# EAGLE design pcbboard (EAGLE 9.6.2)
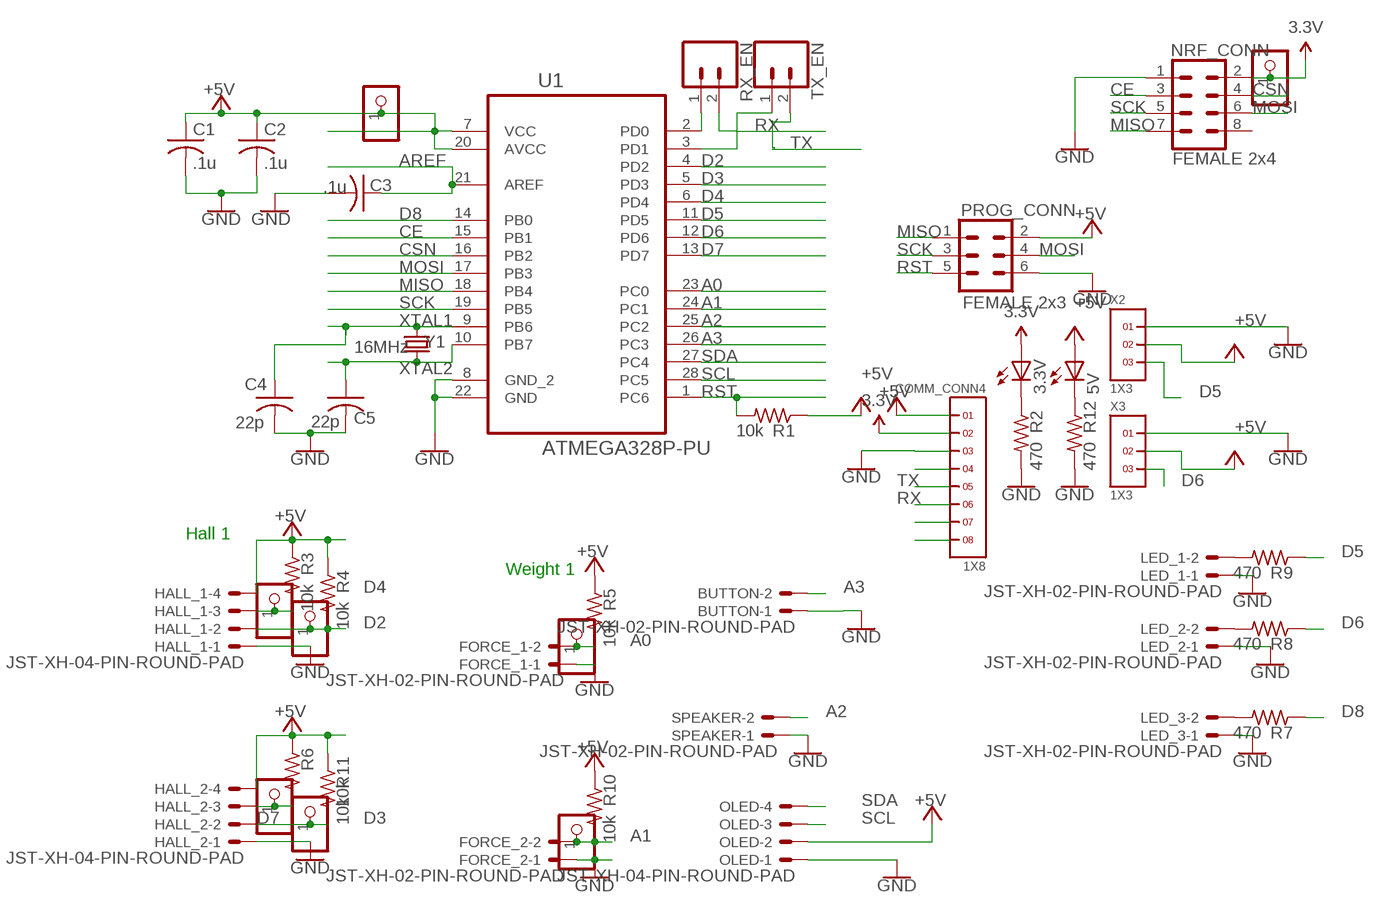
[diagram p0: schematic, sheet 1]

## Parts
3.3V  LED3MM  [LED3MM]
5V  LED3MM  [LED3MM]
BUTTON  JST-XH-02-PIN-ROUND-PAD  [JST-XH-02-PACKAGE-ROUND-PAD]
C1  .1u  C-USC0805  [C0805]
C2  .1u  C-USC0805  [C0805]
C3  .1u  C-USC0805  [C0805]
C4  22p  C-USC0805  [C0805]
C5  22p  C-USC0805  [C0805]
COMM_CONN4  1X8  [1X8]
FORCE_1  JST-XH-02-PIN-ROUND-PAD  [JST-XH-02-PACKAGE-ROUND-PAD]
FORCE_2  JST-XH-02-PIN-ROUND-PAD  [JST-XH-02-PACKAGE-ROUND-PAD]
HALL_1  JST-XH-04-PIN-ROUND-PAD  [JST-XH-04-PACKAGE-ROUND-PAD]
HALL_2  JST-XH-04-PIN-ROUND-PAD  [JST-XH-04-PACKAGE-ROUND-PAD]
LED_1  JST-XH-02-PIN-ROUND-PAD  [JST-XH-02-PACKAGE-ROUND-PAD]
LED_2  JST-XH-02-PIN-ROUND-PAD  [JST-XH-02-PACKAGE-ROUND-PAD]
LED_3  JST-XH-02-PIN-ROUND-PAD  [JST-XH-02-PACKAGE-ROUND-PAD]
NRF_CONN  FEMALE 2x4  CONN_04X2  [2X4]
OLED  JST-XH-04-PIN-ROUND-PAD  [JST-XH-04-PACKAGE-ROUND-PAD]
PROG_CONN  FEMALE 2x3  CONN_03X2FEMALE  [2X3]
R1  10k  R-US_R0805  [R0805]
R2  470  R-US_R0805  [R0805]
R3  10k  R-US_R0805  [R0805]
R4  10k  R-US_R0805  [R0805]
R5  10k  R-US_R0805  [R0805]
R6  10k  R-US_R0805  [R0805]
R7  470  R-US_R0805  [R0805]
R8  470  R-US_R0805  [R0805]
R9  470  R-US_R0805  [R0805]
R10  10k  R-US_R0805  [R0805]
R11  10k  R-US_R0805  [R0805]
R12  470  R-US_R0805  [R0805]
RX_EN  CONN_02  [1X02]
SPEAKER  JST-XH-02-PIN-ROUND-PAD  [JST-XH-02-PACKAGE-ROUND-PAD]
TP_3.3V  PINHD-1X1  [1X01]
TP_5V  PINHD-1X1  [1X01]
TP_F1  PINHD-1X1  [1X01]
TP_F2  PINHD-1X1  [1X01]
TP_H1-1  PINHD-1X1  [1X01]
TP_H1-2  PINHD-1X1  [1X01]
TP_H2-1  PINHD-1X1  [1X01]
TP_H2-2  PINHD-1X1  [1X01]
TX_EN  CONN_02  [1X02]
U1  ATMEGA328P-PU  [DIP254P762X457-28]
X2  1X3  [1X3]
X3  1X3  [1X3]
Y1  16MHz  CRYSTAL-8MHZSMD-5X3.2  [CRYSTAL-SMD-5X3.2-4PAD]

## Nets
3.3V: 3.3V.A COMM_CONN4.2 NRF_CONN.2 TP_3.3V.1
+5V: 5V.A C1.1 C2.1 COMM_CONN4.1 HALL_1.4 HALL_2.4 OLED.2 PROG_CONN.2 R1.1 R3.1 R4.1 R5.1 R6.1 R10.1 R11.1 TP_5V.1 U1.7(VCC) U1.20(AVCC) X2.2 X3.2
A0: FORCE_1.2 R5.2 TP_F1.1 U1.23(PC0)
A1: FORCE_2.2 R10.2 TP_F2.1 U1.24(PC1)
A2: SPEAKER.2 U1.25(PC2)
A3: BUTTON.2 U1.26(PC3)
AREF: C3.1 U1.21(AREF)
CE: NRF_CONN.3 U1.15(PB1)
CSN: NRF_CONN.4 U1.16(PB2)
D2: HALL_1.2 R4.2 TP_H1-2.1 U1.4(PD2)
D3: HALL_2.2 R11.2 TP_H2-2.1 U1.5(PD3)
D4: HALL_1.3 R3.2 TP_H1-1.1 U1.6(PD4)
D5: R9.1 U1.11(PD5) X2.3
D6: R8.1 U1.12(PD6) X3.3
D7: HALL_2.3 R6.2 TP_H2-1.1 U1.13(PD7)
D8: R7.1 U1.14(PB0)
GND: BUTTON.1 C1.2 C2.2 C3.2 C4.2 C5.2 COMM_CONN4.3 FORCE_1.1 FORCE_2.1 HALL_1.1 HALL_2.1 LED_1.1 LED_2.1 LED_3.1 NRF_CONN.1 OLED.1 PROG_CONN.6 R2.2 R12.2 SPEAKER.1 U1.8(GND_2) U1.22(GND) X2.1 X3.1
MISO: NRF_CONN.7 PROG_CONN.1 U1.18(PB4)
MOSI: NRF_CONN.6 PROG_CONN.4 U1.17(PB3)
N$2: LED_3.2 R7.2
N$3: LED_2.2 R8.2
N$4: LED_1.2 R9.2
N$5: COMM_CONN4.4
N$6: 3.3V.K(C) R2.1
N$7: 5V.K(C) R12.1
N$8: COMM_CONN4.7
N$9: COMM_CONN4.8
N$10: RX_EN.1 U1.2(PD0)
N$11: TX_EN.1 U1.3(PD1)
RST: PROG_CONN.5 R1.2 U1.1(PC6)
RX: COMM_CONN4.6 RX_EN.2
SCK: NRF_CONN.5 PROG_CONN.3 U1.19(PB5)
SCL: OLED.3 U1.28(PC5)
SDA: OLED.4 U1.27(PC4)
TX: COMM_CONN4.5 TX_EN.2
XTAL1: C4.1 U1.9(PB6) Y1.1
XTAL2: C5.1 U1.10(PB7) Y1.3
Unconnected: NRF_CONN.8

## Notes on the sheet
- Hall 1
- Weight 1

## Library data of the parts
3.3V 5V = adafruit:LED: LED OSRAM: - CHIPLED LG R971, LG N971, LY N971, LG Q971, LY Q971, LO R971, LY R971 LH N974, LH R974 LS Q976, LO Q976, LY Q976 LO Q996 - Hyper CHIPLED LW Q18S LB Q993, LB Q99A, LB R99A - SideLED LS A670, LO A670, LY A670, LG A670, LP A670 LB A673, LV A673, LT A673, LW A673 LH A674 LY A675 LS A676, LA A676, LO A676, LY A676, LW A676 LS A679, LY A679, LG A679 - Hyper Micro SIDELED® LS Y876, LA Y876, LO Y876, LY Y876 LT Y87S - SmartLED LW L88C, LW L88S LB L89C, LB L89S, LG L890 LS L89K, LO L89K, LY L89K LS L896, LA L896, LO L896, LY L896 - TOPLED LS T670, LO T670, LY T670, LG T670, LP T670 LSG T670, LSP T670, LSY T670, LOP T670, LYG T670 LG T671, LOG T671, LSG T671 LB T673, LV T673, LT T673, LW T673 LH T674 LS T676, LA T676, LO T676, LY T676, LB T676, LH T676, LSB T676, LW T676 LB T67C, LV T67C, LT T67C, LS T67K, LO T67K, LY T67K, LW E67C LS E67B, LA E67B, LO E67B, LY E67B, LB E67C, LV E67C, LT E67C LW T67C LS T679, LY T679, LG T679 LS T770, LO T770, LY T770, LG T770, LP T770 LB T773, LV T773, LT T773, LW T773 LH T774 LS E675, LA E675, LY E675, LS T675 LS T776, LA T776, LO T776, LY T776, LB T776 LHGB T686 LT T68C, LB T68C - Hyper Mini TOPLED® LB M676 - Mini TOPLED Santana® LG M470 LS M47K, LO M47K, LY M47K Source: http://www.osram.convergy.de/
BUTTON FORCE_1 FORCE_2 LED_1-LED_3 SPEAKER = Rembrandt Electronics - JST XH Connectors v1-0:JST-XH-02-PIN: JST XH Connector 2 Pin Wire to board connector. Pitch: 2,54 mm, (0.100") Number of pins: 2 Created by Rembrandt Electronics www.rembrandtelectronics.com
C1-C5 = rcl:C-US: CAPACITOR, American symbol; SPICEPREFIX: C
COMM_CONN4 = headers(2mm):1X8
HALL_1 HALL_2 OLED = Rembrandt Electronics - JST XH Connectors v1-0:JST-XH-04-PIN: JST XH Connector 2 Pin Wire to board connector. Pitch: 2,54 mm, (0.100") Number of pins: 4 Created by Rembrandt Electronics www.rembrandtelectronics.com
NRF_CONN = SparkFun-Connectors:CONN_04X2: Multi connection point. Often used as Generic Header-pin footprint for 0.1 inch spaced/style header connections On any of the 0.1 inch spaced packages, you can populate with these: Break Away Headers - Straight <https://www.sparkfun.com/products/116> (PRT-00116) Break Away Male Headers - Right Angle <https://www.sparkfun.com/products/553> (PRT-00553) Female Headers <https://www.sparkfun.com/products/115> (PRT-00115) Break Away Headers - Machine Pin <https://www.sparkfun.com/products/117> (PRT-00117) Break Away Female Headers - Swiss Machine Pin <https://www.sparkfun.com/products/743> (PRT-00743)
PROG_CONN = SparkFun-Connectors:CONN_03X2: Multi connection point. Often used as Generic Header-pin footprint for 0.1 inch spaced/style header connections You can populate with any combo of single row headers, but if you'd like an exact match, check these: Header - 2x3 (Male, 0.1") <https://www.sparkfun.com/products/12807> (PRT-12807) Header - 2x3 (Female, 0.1") <https://www.sparkfun.com/products/13010> (PRT-13010) 2x3 Pin Shrouded Header <https://www.sparkfun.com/products/10877> (PRT-10877) On any of the 0.1 inch spaced packages, you can populate with these: Break Away Headers - Straight <https://www.sparkfun.com/products/116> (PRT-00116) Break Away Male Headers - Right Angle <https://www.sparkfun.com/products/553> (PRT-00553) Female Headers <https://www.sparkfun.com/products/115> (PRT-00115) Break Away Headers - Machine Pin <https://www.sparkfun.com/products/117> (PRT-00117) Break Away Female Headers - Swiss Machine Pin <https://www.sparkfun.com/products/743> (PRT-00743) Special note: the shrouded connector mates well with our 3x2 ribbon cables: Ribbon Crimp Connector - 6-pin (2x3, Female) <https://www.sparkfun.com/products/10651> (PRT-10651) Ribbon Cable - 6 wire (15ft) <https://www.sparkfun.com/products/10646> (PRT-10646); PROD_ID: CONN-11566
R1-R12 = rcl:R-US_: RESISTOR, American symbol; SPICEPREFIX: R
RX_EN TX_EN = SparkFun-Connectors:CONN_02: Multi connection point. Often used as Generic Header-pin footprint for 0.1 inch spaced/style header connections On any of the 0.1 inch spaced packages, you can populate with these: Break Away Headers - Straight <https://www.sparkfun.com/products/116> (PRT-00116) Break Away Male Headers - Right Angle <https://www.sparkfun.com/products/553> (PRT-00553) Female Headers <https://www.sparkfun.com/products/115> (PRT-00115) Break Away Headers - Machine Pin <https://www.sparkfun.com/products/117> (PRT-00117) Break Away Female Headers - Swiss Machine Pin <https://www.sparkfun.com/products/743> (PRT-00743) For SCREWTERMINALS and SPRING TERMINALS visit here: Screw Terimnals on SparkFun.com <https://www.sparkfun.com/search/results?term=Screw+Terminals> (5mm/3.5mm/2.54mm spacing) This device is also useful as a general connection point to wire up your design to another part of your project. Our various solder wires solder well into these plated through hole pads. Hook-Up Wire - Assortment (Stranded, 22 AWG) <https://www.sparkfun.com/products/11375> (PRT-11375) Hook-Up Wire - Assortment (Solid Core, 22 AWG) <https://www.sparkfun.com/products/11367> (PRT-11367) View the entire wire category on our website here <https://www.sparkfun.com/categories/141> Special notes: Molex polarized connector foot print use with: PRT-08233 with associated crimp pins and housings. 2.54_SCREWTERM for use with PRT-10571. 3.5mm Screw Terminal footprints for PRT-08084 5mm Screw Terminal footprints for use with PRT-08432
TP_3.3V TP_5V TP_F1 TP_F2 TP_H1-1 TP_H1-2 TP_H2-1 TP_H2-2 = pinhead:PINHD-1X1: PIN HEADER
U1 = Atmel_By_element14_Batch_1-00:ATMEGA328P-PU: 8-bit Microcontroller with In-System Programmable Flash; MPN: ATMEGA328P-PU; OC_FARNELL: 1715487; OC_NEWARK: 15R0268; PACKAGE: PDIP-28; SUPPLIER: Atmel
X2 X3 = headers(2mm):1X3
Y1 = SparkFun-Clocks:CRYSTAL-8MHZ: 8MHz Crystal Datasheet Example <http://www.futureelectronics.com/en/technologies/electromechanical/timing-devices/crystals/Pages/6008189-ABM3B-8.000MHZ-B2-T.aspx?IM=0> Frequency: 8MHz Frequency Tolerance: ±20ppm Load Capacitance: 18pF SparkFun Products: Pro Micro -3.3V/8MHz <https://www.sparkfun.com/products/12587> WAV Trigger <https://www.sparkfun.com/products/13660>; PROD_ID: XTAL-09431; VALUE: 8MHz

## Board
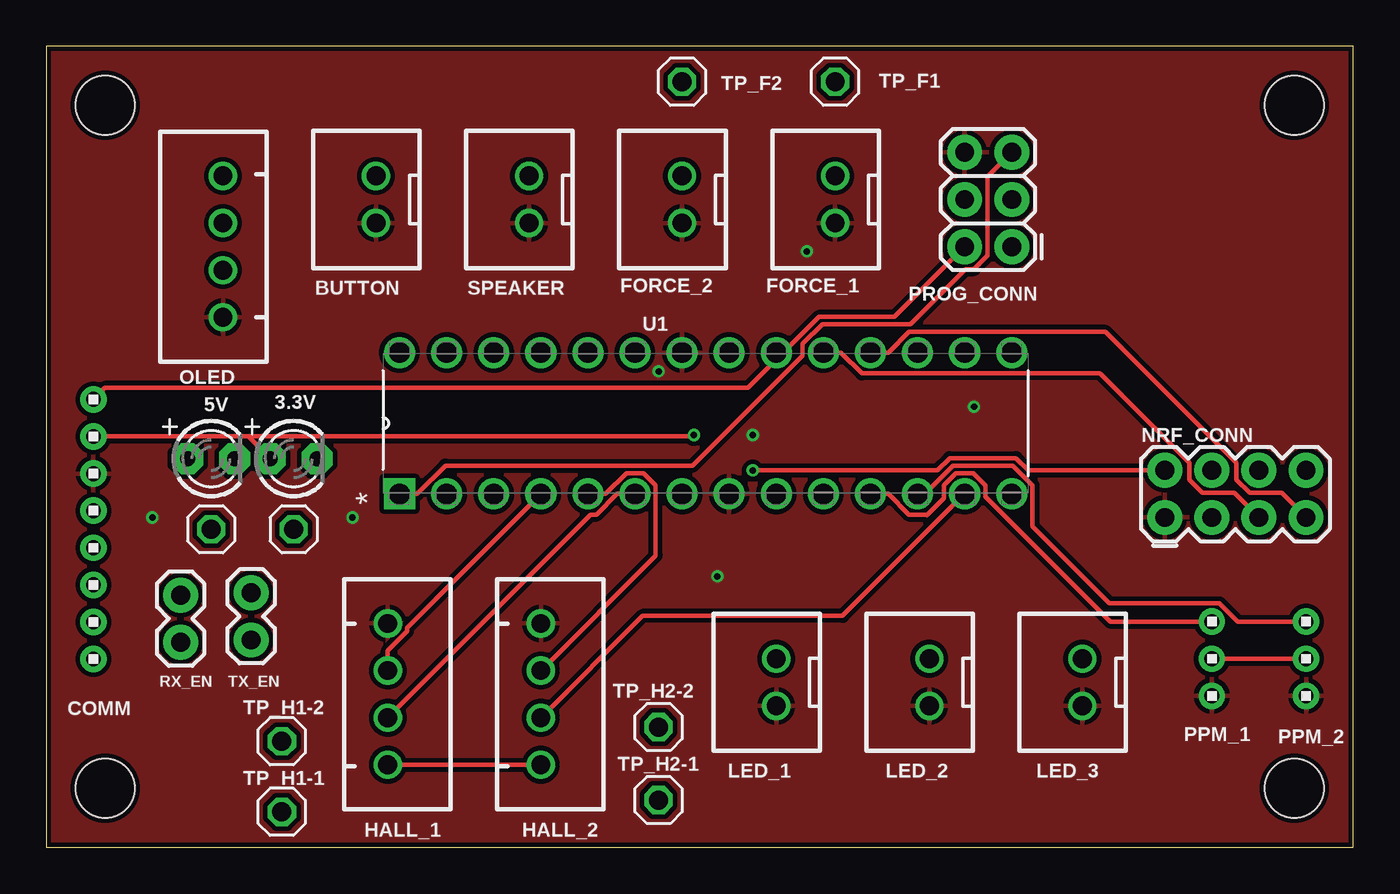
[diagram p1: board, top side]
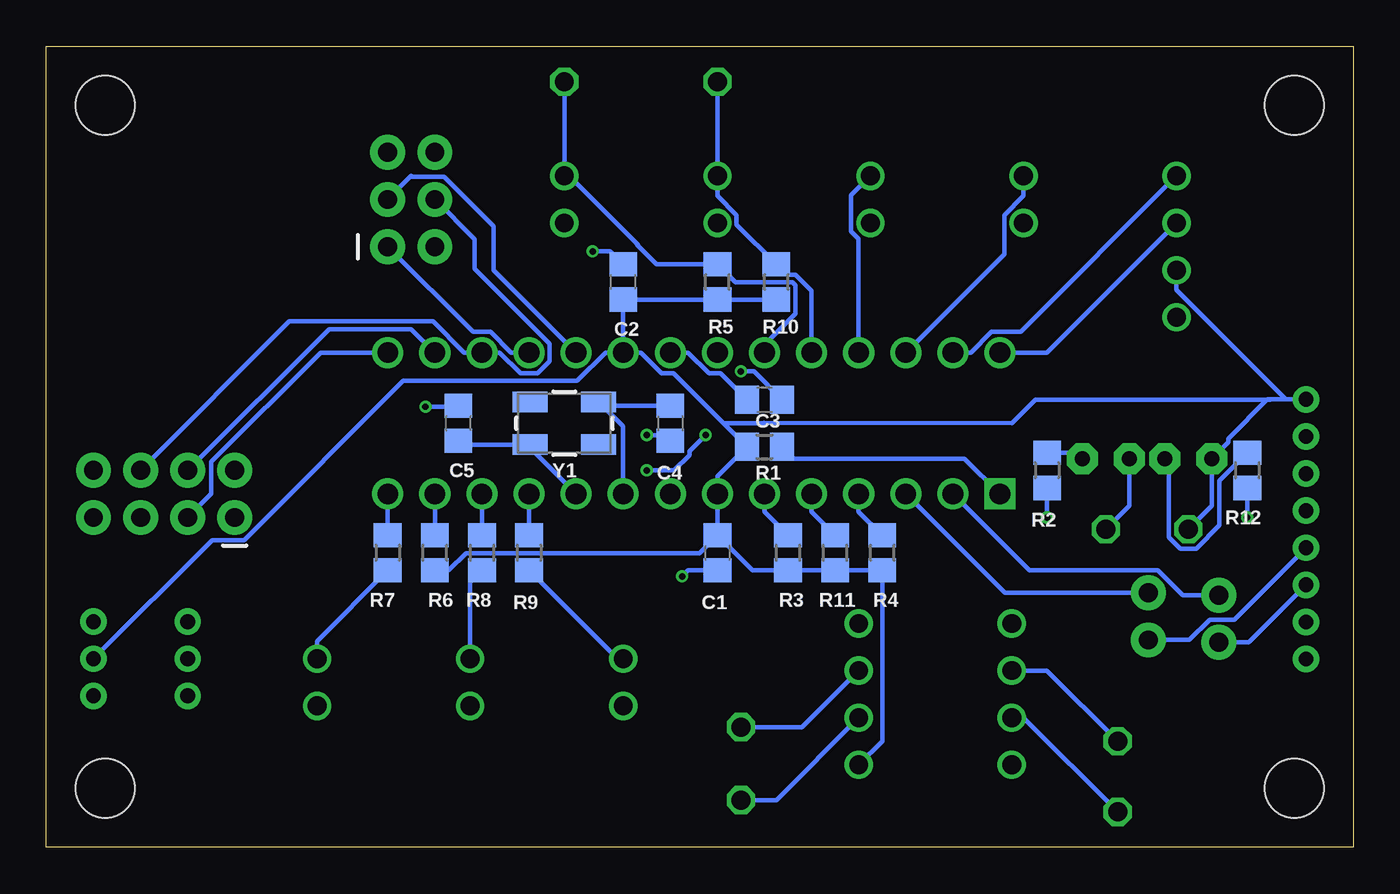
[diagram p2: board, bottom side, seen from below]

Size 70.48 x 43.18 mm. Coordinates in mm from the lower left corner, seen from the top.
Outline: 0,0 70.48,0 70.48,43.18 0,43.18 0,0
Copper layers (1*16): Top 0.035mm / dielectric 1.5mm / Bottom 0.035mm
Design rules "PCBWay_2layer": minimum track width 6mil, minimum drill 0.3mm, track to track 6mil, track to pad 6mil, pad to pad 6mil, via to via 6mil, smd to smd 4mil, copper to edge 10mil, drill to drill 6mil, minimum pad ring 6mil, minimum via ring 6mil, stop-mask expansion 4mil, vias tented up to drill 0.8mm, thermal gap 10mil
Holes 3.2 mm at 3.18,40.01 3.18,3.17 67.31,3.17 67.31,40.01

### Footprints (pad centres in the part's own frame; a part is rotated, then mirrored left to right if it is on the bottom)
LED3MM = drill 0.813 pad 1.676 octagon: A -1.27,0; K 1.27,0
JST-XH-02-PACKAGE-ROUND-PAD = drill 1.016: 1 -1.27,0; 2 1.27,0
C0805 = smd 1.3 x 1.5: 1 -0.95,0; 2 0.95,0
1X8 = drill 0.8 pad 1.422: 1 -7,0; 2 -5,0; 3 -3,0; 4 -1,0; 5 1,0; 6 3,0; 7 5,0; 8 7,0
JST-XH-04-PACKAGE-ROUND-PAD = drill 1.016: 1 -3.81,0; 2 -1.27,0; 3 1.27,0; 4 3.81,0
2X4 = drill 1.016 pad 1.88: 1 -3.81,-1.27; 2 -3.81,1.27; 3 -1.27,-1.27; 4 -1.27,1.27; 5 1.27,-1.27; 6 1.27,1.27; 7 3.81,-1.27; 8 3.81,1.27
2X3 = drill 1.016 pad 1.88: 1 0,0; 2 0,2.54; 3 2.54,0; 4 2.54,2.54; 5 5.08,0; 6 5.08,2.54
R0805 = smd 1.3 x 1.5: 1 -0.95,0; 2 0.95,0
1X02 = drill 1.016 pad 1.88: 1 0,0; 2 2.54,0
1X01 = drill 1.016 octagon: 1 0,0
DIP254P762X457-28 = drill 1.118 square: 1 -7.62,33.02 | drill 1.118: 2 -7.62,30.48; 3 -7.62,27.94; 4 -7.62,25.4; 5 -7.62,22.86; 6 -7.62,20.32; 7 -7.62,17.78; 8 -7.62,15.24; 9 -7.62,12.7; 10 -7.62,10.16; 11 -7.62,7.62; 12 -7.62,5.08; 13 -7.62,2.54; 14 -7.62,0; 15 0,0; 16 0,2.54; 17 0,5.08; 18 0,7.62; 19 0,10.16; 20 0,12.7; 21 0,15.24; 22 0,17.78; 23 0,20.32; 24 0,22.86; 25 0,25.4; 26 0,27.94; 27 0,30.48; 28 0,33.02
1X3 = drill 0.8 pad 1.422: 1 -2,0; 2 0,0; 3 2,0
CRYSTAL-SMD-5X3.2-4PAD = smd 1.9 x 1.1: 1 -1.85,-1.15; 2 1.85,-1.15; 3 1.85,1.15; 4 -1.85,1.15

### Placement (x,y rotation side)
3.3V  13.34,20.95 0 top
5V  8.89,20.95 0 top
BUTTON  17.78,34.92 90 top
C1  34.29,15.88 270 bottom
C2  39.37,30.48 90 bottom
C3  31.75,24.13 0 bottom
C4  36.83,22.86 270 bottom
C5  48.26,22.86 90 bottom
COMM_CONN4  2.54,17.14 270 top
FORCE_1  42.55,34.92 90 top
FORCE_2  34.29,34.92 90 top
HALL_1  18.41,8.25 270 top
HALL_2  26.67,8.25 270 top
LED_1  39.37,8.89 90 top
LED_2  47.62,8.89 90 top
LED_3  55.88,8.89 90 top
NRF_CONN  64.13,19.05 0 top
OLED  9.53,32.38 90 top
PROG_CONN  52.07,32.38 90 top
R1  31.75,21.59 0 bottom
R2  16.51,20.32 270 bottom
R3  30.48,15.88 90 bottom
R4  25.4,15.88 90 bottom
R5  34.29,30.48 90 bottom
R6  49.53,15.88 90 bottom
R7  52.07,15.88 270 bottom
R8  46.99,15.88 270 bottom
R9  44.45,15.88 270 bottom
R10  31.12,30.48 90 bottom
R11  27.94,15.88 90 bottom
R12  5.71,20.32 270 bottom
RX_EN  7.24,13.59 270 top
SPEAKER  26.04,34.92 90 top
TP_3.3V  13.34,17.14 0 top
TP_5V  8.89,17.14 0 top
TP_F1  42.55,41.27 270 top
TP_F2  34.29,41.27 270 top
TP_H1-1  12.7,1.91 270 top
TP_H1-2  12.7,5.71 270 top
TP_H2-1  33.02,2.54 270 top
TP_H2-2  33.02,6.48 270 top
TX_EN  11.05,13.72 270 top
U1  52.07,26.67 90 top
X2  62.87,10.16 90 top
X3  67.94,10.16 90 top
Y1  42.55,22.86 180 bottom

### Tracks (layer width: path | path; a pad name or v marks a point on that pad's centre or on a via)
3.3V  (via drill 0.35)
  Top 0.254: 3.3V.A 10.88,22.14 COMM_CONN4.2 34.84,22.14 v34.92,22.22 | v38.1,20.32 48.07,20.32 48.73,20.98 52.3,20.98 52.95,20.32 NRF_CONN.2
  Bottom 0.254: TP_3.3V.1 12.06,18.41 3.3V.A | v34.92,22.22 35.8,21.35 35.8,21.14 36.62,20.32 v38.1,20.32
+5V
  Top 0.254: HALL_1.4 HALL_2.4 | PROG_CONN.2 45.75,28.6 41.69,28.6 37.85,24.77 3.16,24.77 COMM_CONN4.1 | X2.2 X3.2
  Bottom 0.254: 33.96,22.85 R1.1 34.29,20 U1.7 C1.1 | U1.20 38.41,26.67 37.29,25.55 36.66,25.55 33.96,22.85 | U1.20 C2.1 34.92,29.53 | 34.92,29.53 R5.1 | R10.1 34.92,29.53 | TP_5V.1 7.62,18.41 5V.A 6.74,21.83 6.74,22.04 4.63,24.14 COMM_CONN4.1 | COMM_CONN4.1 4.45,24.14 4.46,24.13 17.14,24.13 18.41,22.86 31.77,22.88 31.77,22.85 33.96,22.85 | COMM_CONN4.1 3.62,24.14 9.53,30.05 OLED.2 | C1.1 32.39,14.93 R3.1 R11.1 R4.1 25.4,5.71 HALL_2.4 | R6.1 48.78,14.93 47.86,15.85 35.26,15.85 C1.1 | X3.2 61.54,16.56 59.82,16.56 51.23,25.15 41.85,25.15 40.33,26.67 U1.20
A0
  Bottom 0.254: U1.23 31.75,27.1 30.09,28.76 30.09,30.3 30.25,30.46 33.32,30.46 R5.2 37.58,31.43 38.63,32.49 38.58,32.49 42.29,36.2 FORCE_1.2 TP_F1.1
A1
  Bottom 0.254: U1.24 29.21,29.99 30.08,30.87 30.55,30.87 R10.2 33.25,33.56 33.25,34.09 34.29,35.13 FORCE_2.2 TP_F2.1
A2
  Bottom 0.254: U1.25 26.67,32.82 27.08,33.22 27.08,35.15 SPEAKER.2
A3
  Bottom 0.254: U1.26 18.82,31.98 18.82,34.09 17.78,35.13 BUTTON.2
AREF
  Bottom 0.254: C3.1 34.12,25.55 34.75,25.55 35.87,26.67 U1.21
CE
  Bottom 0.254: NRF_CONN.3 61.59,19.05 61.59,20.77 55.7,26.67 U1.15
CSN
  Bottom 0.254: U1.16 50.8,27.94 55.24,27.94 NRF_CONN.4
D2
  Top 0.254: U1.4 19.46,11.84 19.46,11.63 18.41,10.59 HALL_1.2
  Bottom 0.254: 24.84,16.26 R4.2 26.67,18.09 U1.4 | TP_H1-2.1 16.51,9.53 HALL_1.2
D3
  Top 0.254: U1.5 30.17,19.05 31.29,20.17 32.21,20.17 32.87,19.51 32.87,15.72 HALL_2.2
  Bottom 0.254: U1.5 29.21,18.09 R11.2 | TP_H2-2.1 29.72,6.48 HALL_2.2
D4
  Top 0.254: HALL_1.3 29.36,17.93 29.67,17.93 30.79,19.05 U1.6
  Bottom 0.254: U1.6 31.75,18.09 R3.2 | TP_H1-1.1 17.78,6.99 HALL_1.3
D5
  Top 0.254: U1.11 45.41,19.05 46.53,17.93 47.47,17.93 47.5,17.91 48.41,18.82 48.41,19.51 49.07,20.17 49.99,20.17 50.65,19.51 50.65,18.89 57.38,12.16 X2.3
  Bottom 0.254: U1.11 R9.1
D6
  Top 0.254: U1.12 47.38,19.05 48.9,20.57 52.13,20.57 53.19,19.51 53.19,17.3 57.33,13.15 63.27,13.15 64.27,12.16 X3.3
  Bottom 0.254: U1.12 R8.1
D7
  Top 0.254: U1.13 42.95,12.47 32.16,12.47 HALL_2.3
  Bottom 0.254: U1.13 R6.2 | TP_H2-1.1 31.12,2.54 HALL_2.3
D8
  Bottom 0.254: U1.14 R7.1
GND  (via drill 0.35)
  Bottom 0.254: C4.2 37.14,22.22 v38.1,22.22 | v16.51,17.78 R2.2 | C1.2 35.88,14.93 v36.2,14.61 | C2.2 40.07,32.13 v41.02,32.13 | R12.2 v5.71,17.78 | v50.04,23.75 48.32,23.75 C5.2 | C3.2 32.32,25.65 v33.02,25.65
  pour Top (isolate 0.254): -0.63,43.81 71.12,43.81 71.12,-1.27 -0.63,-1.27 -1.27,-0.63 -1.27,43.18
MISO
  Top 0.254: NRF_CONN.7 66.62,19.1 64.9,19.1 64.19,19.81 64.19,20.72 57.12,27.79 46.53,27.79 45.41,26.67 U1.18
  Bottom 0.254: PROG_CONN.1 47.47,27.79 46.53,27.79 45.41,26.67 U1.18
MOSI
  Bottom 0.254: PROG_CONN.4 47.4,32.79 47.4,31.2 43.33,27.13 43.33,26.21 43.99,25.55 44.91,25.55 46.03,26.67 U1.17 47.95,26.67 49.63,28.35 57.38,28.35 NRF_CONN.6
N$2
  Bottom 0.254: R7.2 55.88,11.11 LED_3.2
N$3
  Bottom 0.254: R8.2 47.62,14.29 LED_2.2
N$4
  Bottom 0.254: R9.2 39.69,10.16 LED_1.2
N$6
  Bottom 0.254: R2.1 14.92,21.27 3.3V.K
N$7
  Bottom 0.254: R12.1 7.21,19.77 7.21,17.35 8.46,16.1 9.32,16.1 9.93,16.71 9.93,20.73 5V.K
N$10
  Bottom 0.254: RX_EN.1 9.2,13.59 10.54,14.93 17.48,14.93 U1.2
N$11
  Bottom 0.254: TX_EN.1 18.8,13.72 U1.3
RST
  Top 0.254: PROG_CONN.5 50.75,36.14 50.75,31.88 50.03,31.17 49.58,31.17 46.61,28.19 41.85,28.19 40.79,27.13 40.79,26.51 34.86,20.57 21.53,20.57 20.01,19.05 U1.1
  Bottom 0.254: R1.2 30.16,20.95 20.96,20.95 U1.1
RX
  Bottom 0.254: COMM_CONN4.6 5.64,11.05 RX_EN.2
SCK
  Top 0.254: NRF_CONN.5 64.08,19.1 62.36,19.1 61.65,19.81 61.65,20.72 56.82,25.55 43.99,25.55 42.87,26.67 U1.19
  Bottom 0.254: U1.19 46.36,31.11 46.36,33.47 49.02,36.14 50.75,36.14 50.8,36.2 PROG_CONN.3
SCL
  Bottom 0.254: U1.28 16.51,26.67 OLED.3
SDA
  Bottom 0.254: U1.27 20.63,26.67 19.51,27.79 17.93,27.79 OLED.4
TX
  Bottom 0.254: COMM_CONN4.5 6.42,12.27 7.74,12.27 8.84,11.18 TX_EN.2
XTAL1
  Bottom 0.254: U1.9 39.37,22.68 Y1.1 40.5,23.81 C4.1
XTAL2
  Bottom 0.254: C5.1 48.06,21.71 Y1.3 44.39,21.54 U1.10

### Text on the board
tNames: COMM | PPM_1 | PPM_2